# EAGLE design module (EAGLE 9.5.1)

## Sheet 1 of 2: Connector
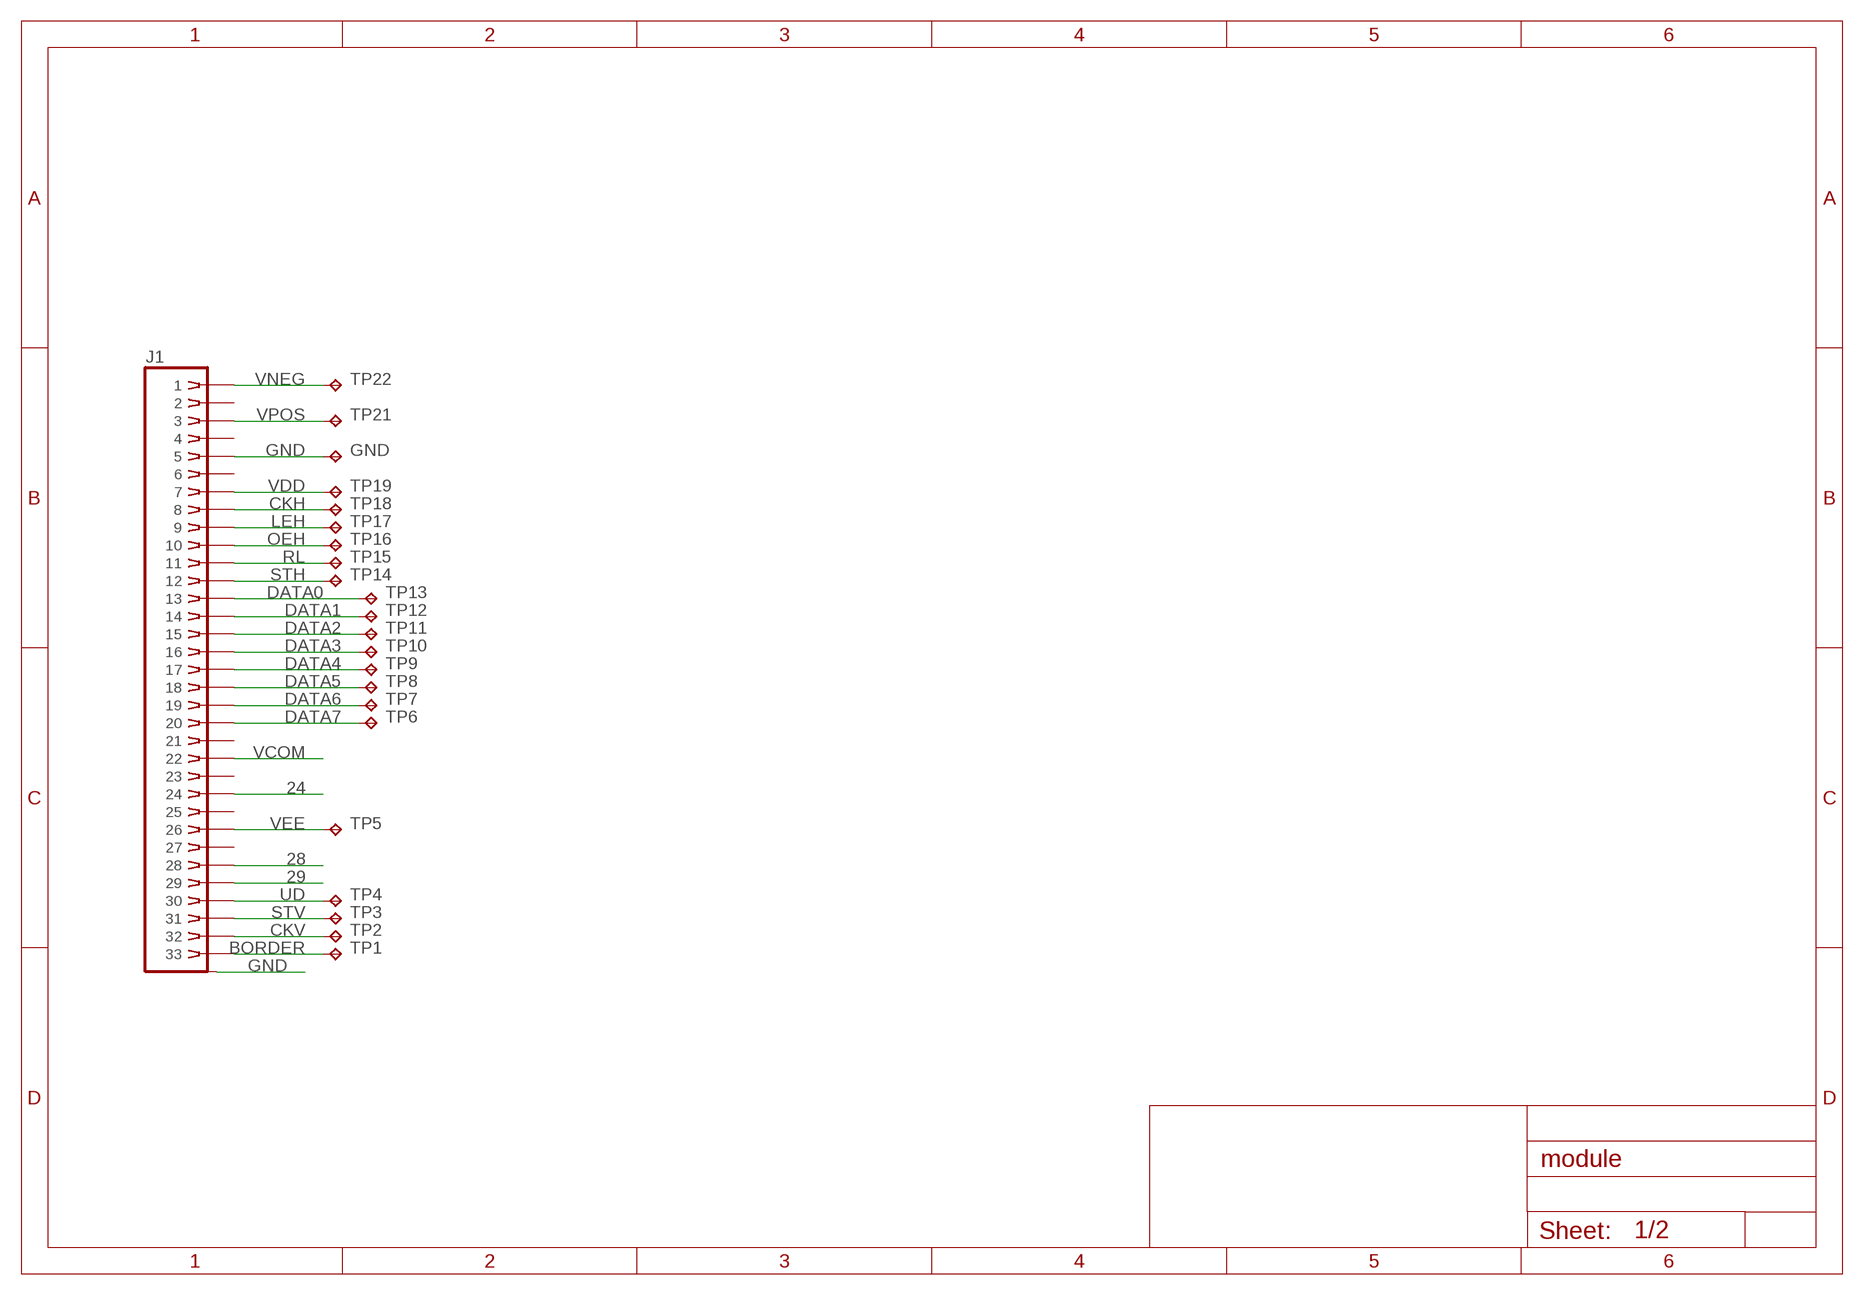
[diagram p0: schematic, sheet 1]

### Parts
GND  TPB1,27  [B1,27]
J1  SFV33R  [SFV33R-1STE1LF]
TP1  TPB1,27  [B1,27]
TP2  TPB1,27  [B1,27]
TP3  TPB1,27  [B1,27]
TP4  TPB1,27  [B1,27]
TP5  TPB1,27  [B1,27]
TP6  TPB1,27  [B1,27]
TP7  TPB1,27  [B1,27]
TP8  TPB1,27  [B1,27]
TP9  TPB1,27  [B1,27]
TP10  TPB1,27  [B1,27]
TP11  TPB1,27  [B1,27]
TP12  TPB1,27  [B1,27]
TP13  TPB1,27  [B1,27]
TP14  TPB1,27  [B1,27]
TP15  TPB1,27  [B1,27]
TP16  TPB1,27  [B1,27]
TP17  TPB1,27  [B1,27]
TP18  TPB1,27  [B1,27]
TP19  TPB1,27  [B1,27]
TP21  TPB1,27  [B1,27]
TP22  TPB1,27  [B1,27]

### Nets
24: J1.24
28: J1.28
29: J1.29
BORDER: J1.33 TP1.TP
CKH: J1.8 TP18.TP
CKV: J1.32 TP2.TP
DATA0: J1.13 TP13.TP
DATA1: J1.14 TP12.TP
DATA2: J1.15 TP11.TP
DATA3: J1.16 TP10.TP
DATA4: J1.17 TP9.TP
DATA5: J1.18 TP8.TP
DATA6: J1.19 TP7.TP
DATA7: J1.20 TP6.TP
GND: GND.TP J1.5 J1.SHLD1(SHLD) J1.SHLD2(SHLD) ; also sheet 2
LEH: J1.9 TP17.TP
OEH: J1.10 TP16.TP
RL: J1.11 TP15.TP
STH: J1.12 TP14.TP
STV: J1.31 TP3.TP
UD: J1.30 TP4.TP
VCOM: J1.22 ; also sheet 2
VDD: J1.7 TP19.TP
VEE: J1.26 TP5.TP ; also sheet 2
VNEG: J1.1 TP22.TP ; also sheet 2
VPOS: J1.3 TP21.TP ; also sheet 2
Unconnected: J1.2 J1.4 J1.6 J1.21 J1.23 J1.25 J1.27

## Sheet 2 of 2: Power
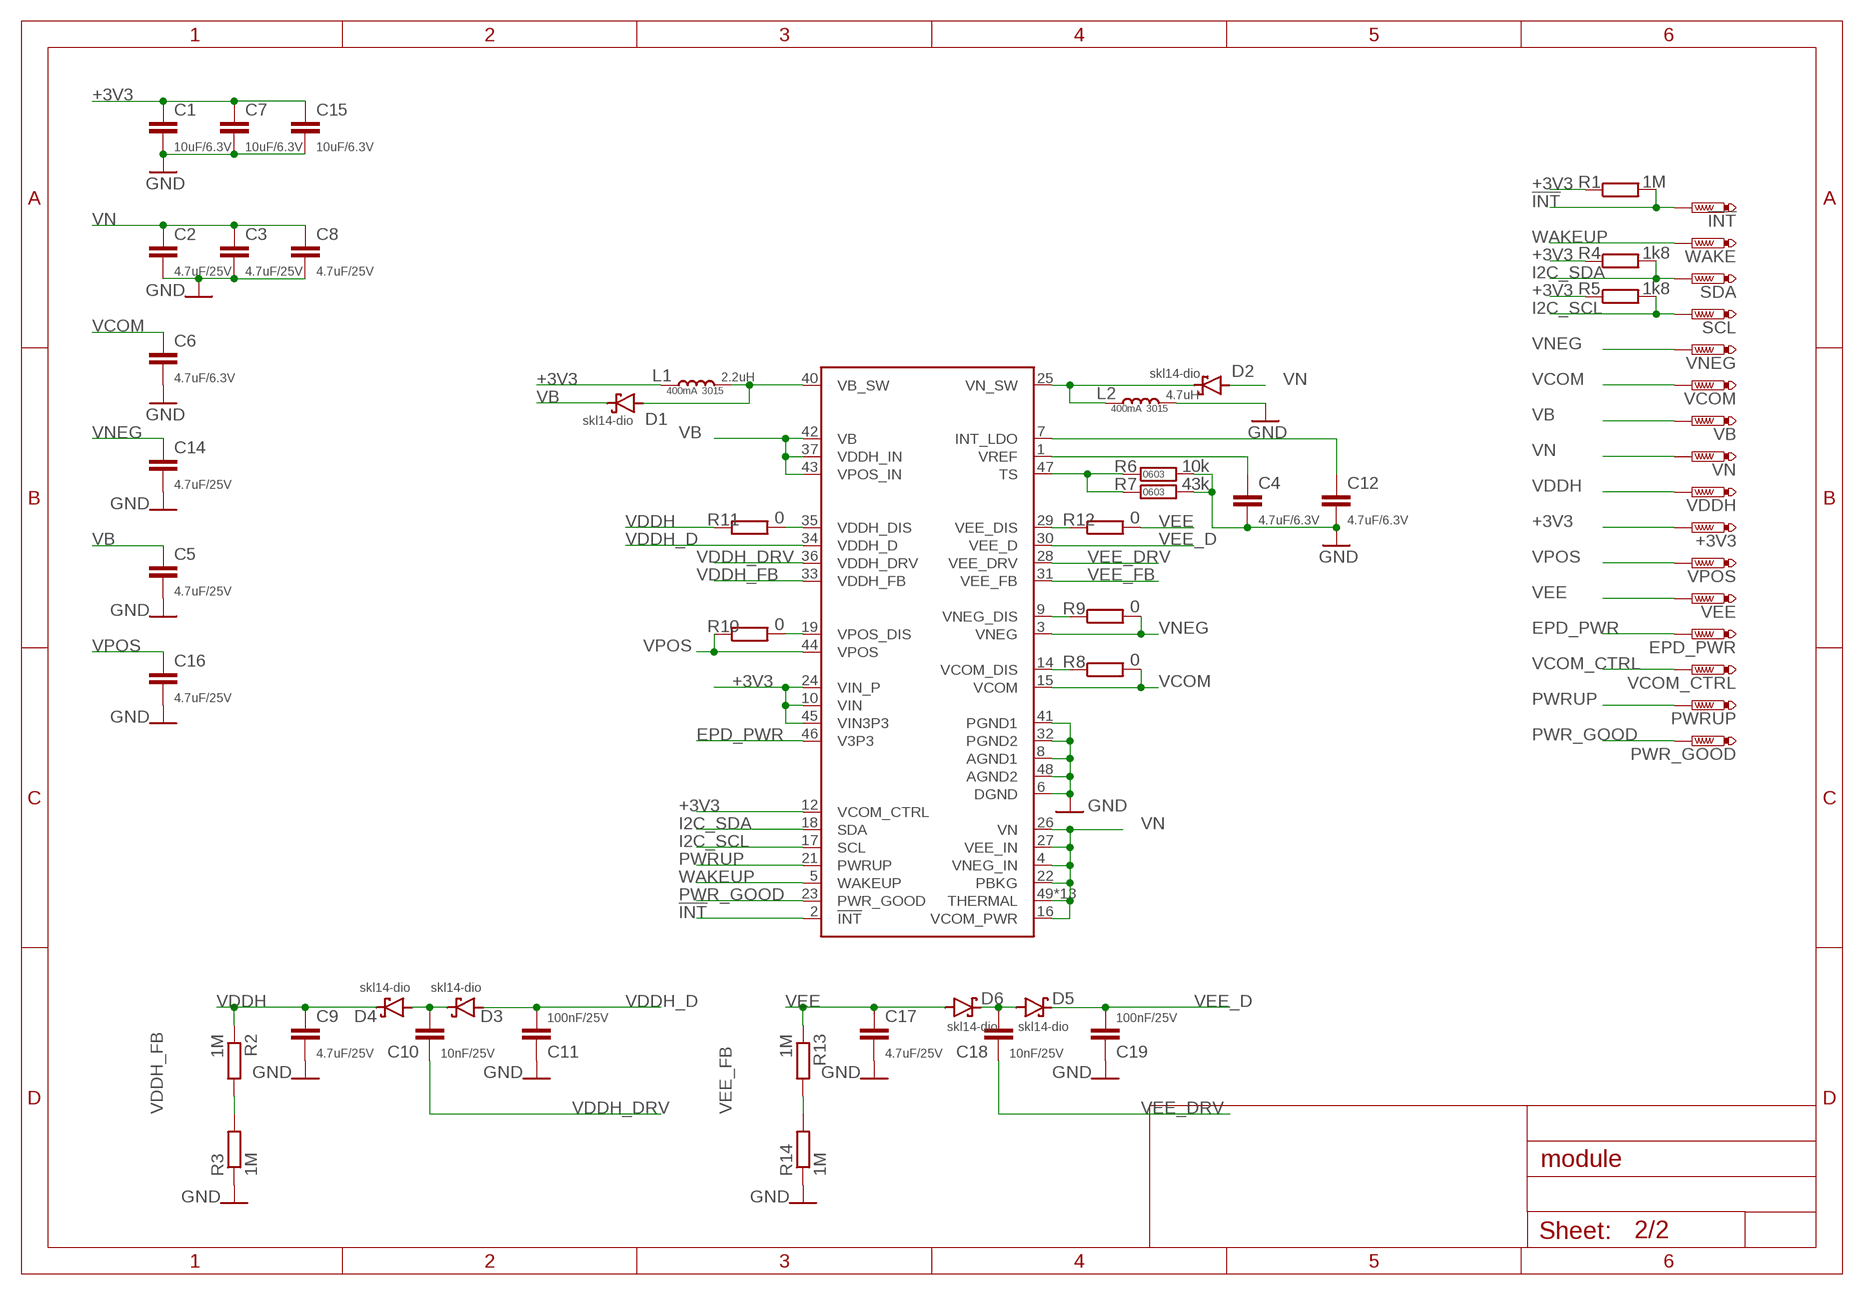
[diagram p1: schematic, sheet 2]

### Parts
!INT  PTR1B1,27  [B1,27]
+3V3  PTR1B1,27  [B1,27]
C1  10uF/6.3V  C-EUC0805  [C0805]
C2  4.7uF/25V  C-EUC0805  [C0805]
C3  4.7uF/25V  C-EUC0805  [C0805]
C4  4.7uF/6.3V  C-EUC0603  [C0603]
C5  4.7uF/25V  C-EUC0805  [C0805]
C6  4.7uF/6.3V  C-EUC0603  [C0603]
C7  10uF/6.3V  C-EUC0805  [C0805]
C8  4.7uF/25V  C-EUC0805  [C0805]
C9  4.7uF/25V  C-EUC0805  [C0805]
C10  10nF/25V  C-EUC0402  [C0402]
C11  100nF/25V  C-EUC0603  [C0603]
C12  4.7uF/6.3V  C-EUC0603  [C0603]
C14  4.7uF/25V  C-EUC0805  [C0805]
C15  10uF/6.3V  C-EUC0805  [C0805]
C16  4.7uF/25V  C-EUC0805  [C0805]
C17  4.7uF/25V  C-EUC0805  [C0805]
C18  10nF/25V  C-EUC0402  [C0402]
C19  100nF/25V  C-EUC0603  [C0603]
D1  skl14-dio  SKL14  [SODFL3718X130]
D2  skl14-dio  SKL14  [SODFL3718X130]
D3  skl14-dio  SKL14  [SODFL3718X130]
D4  skl14-dio  SKL14  [SODFL3718X130]
D5  skl14-dio  SKL14  [SODFL3718X130]
D6  skl14-dio  SKL14  [SODFL3718X130]
EPD_PWR  PTR1B1,27  [B1,27]
L1  2.2uH  DJNR3015  [L3230M]
L2  4.7uH  DJNR3015  [L3230M]
PWR_GOOD  PTR1B1,27  [B1,27]
PWRUP  PTR1B1,27  [B1,27]
R1  1M  R-EU_R0603  [R0603]
R2  1M  R-EU_R0603  [R0603]
R3  1M  R-EU_R0603  [R0603]
R4  1k8  R-EU_R0603  [R0603]
R5  1k8  R-EU_R0603  [R0603]
R6  10k  RES-0603  [R0603]
R7  43k  RES-0603  [R0603]
R8  0  R-EU_R0402  [R0402]
R9  0  R-EU_R0402  [R0402]
R10  0  R-EU_R0402  [R0402]
R11  0  R-EU_R0402  [R0402]
R12  0  R-EU_R0402  [R0402]
R13  1M  R-EU_R0603  [R0603]
R14  1M  R-EU_R0603  [R0603]
SCL  PTR1B1,27  [B1,27]
SDA  PTR1B1,27  [B1,27]
U1  TPS65185  [QFN50P700X700X100-49T410]
VB  PTR1B1,27  [B1,27]
VCOM  PTR1B1,27  [B1,27]
VCOM_CTRL  PTR1B1,27  [B1,27]
VDDH  PTR1B1,27  [B1,27]
VEE  PTR1B1,27  [B1,27]
VN  PTR1B1,27  [B1,27]
VNEG  PTR1B1,27  [B1,27]
VPOS  PTR1B1,27  [B1,27]
WAKE  PTR1B1,27  [B1,27]

### Nets
!INT: !INT.TP R1.2 U1.2(!INT)
+3V3: +3V3.TP C1.1 C7.1 C15.1 L1.1 R1.1 R4.1 R5.1 U1.10(VIN) U1.12(VCOM_CTRL) U1.24(VIN_P) U1.45(VIN3P3)
EPD_PWR: EPD_PWR.TP U1.46(V3P3)
GND: C1.2 C2.2 C3.2 C4.2 C5.2 C6.2 C7.2 C8.2 C9.2 C11.2 C12.2 C14.2 C15.2 C16.2 C17.2 C19.2 L2.2 R3.1 R6.2 R7.2 R14.1 U1.6(DGND) U1.8(AGND1) U1.32(PGND2) U1.41(PGND1) U1.48(AGND2) ; also sheet 1
I2C_SCL: R5.2 SCL.TP U1.17(SCL)
I2C_SDA: R4.2 SDA.TP U1.18(SDA)
N$1: C12.1 U1.7(INT_LDO)
N$2: D1.A L1.2 U1.40(VB_SW)
N$3: D2.C L2.1 U1.25(VN_SW)
N$4: C4.1 U1.1(VREF)
N$6: C10.1 D3.C D4.A
N$7: R8.1 U1.14(VCOM_DIS)
N$8: C18.1 D5.A D6.C
N$9: R9.1 U1.9(VNEG_DIS)
N$11: R10.2 U1.19(VPOS_DIS)
N$14: R12.1 U1.29(VEE_DIS)
N$15: R11.2 U1.35(VDDH_DIS)
NTC_SENSE: R6.1 R7.1 U1.47(TS)
PWR_GOOD: PWR_GOOD.TP U1.23(PWR_GOOD)
PWRUP: PWRUP.TP U1.21(PWRUP)
VB: C5.1 D1.C U1.37(VDDH_IN) U1.42(VB) U1.43(VPOS_IN) VB.TP
VCOM: C6.1 R8.2 U1.15(VCOM) VCOM.TP ; also sheet 1
VCOM_CTRL: VCOM_CTRL.TP
VDDH: C9.1 D4.C R2.1 R11.1 VDDH.TP
VDDH_D: C11.1 D3.A U1.34(VDDH_D)
VDDH_DRV: C10.2 U1.36(VDDH_DRV)
VDDH_FB: R2.2 R3.2 U1.33(VDDH_FB)
VEE: C17.1 D6.A R12.2 R13.1 VEE.TP ; also sheet 1
VEE_D: C19.1 D5.C U1.30(VEE_D)
VEE_DRV: C18.2 U1.28(VEE_DRV)
VEE_FB: R13.2 R14.2 U1.31(VEE_FB)
VN: C2.1 C3.1 C8.1 D2.A U1.4(VNEG_IN) U1.16(VCOM_PWR) U1.22(PBKG) U1.26(VN) U1.27(VEE_IN) U1.49(THERMAL) U1.P$1(THERMAL) U1.P$2(THERMAL) U1.P$3(THERMAL) U1.P$4(THERMAL) U1.P$5(THERMAL) U1.P$6(THERMAL) U1.P$7(THERMAL) U1.P$8(THERMAL) U1.P$9(THERMAL) U1.P$10(THERMAL) U1.P$11(THERMAL) U1.P$12(THERMAL) VN.TP
VNEG: C14.1 R9.2 U1.3(VNEG) VNEG.TP ; also sheet 1
VPOS: C16.1 R10.1 U1.44(VPOS) VPOS.TP ; also sheet 1
WAKEUP: U1.5(WAKEUP) WAKE.TP

## Library data of the parts
!INT +3V3 EPD_PWR PWR_GOOD PWRUP SCL SDA VB VCOM VCOM_CTRL VDDH VEE VN VNEG VPOS WAKE = testpad:PTR1: TEST PIN
C1-C12 C14-C19 = rcl:C-EU: CAPACITOR, European symbol; SPICEPREFIX: C
D1-D6 = parts-diotec:SKL
GND TP1-TP19 TP21 TP22 = testpad:TP: Test pad
J1 = parts-amphenol:SFV33R
L1 L2 = parts-ferrocore:DJNR3015; CURRENT: 400mA; PACKAGE: 3015
R1-R5 R8-R14 = rcl:R-EU_: RESISTOR, European symbol; SPICEPREFIX: R
R6 R7 = parts-passives:RES-; PACKAGE: 0603
U1 = parts-ti:TPS65185

## Board
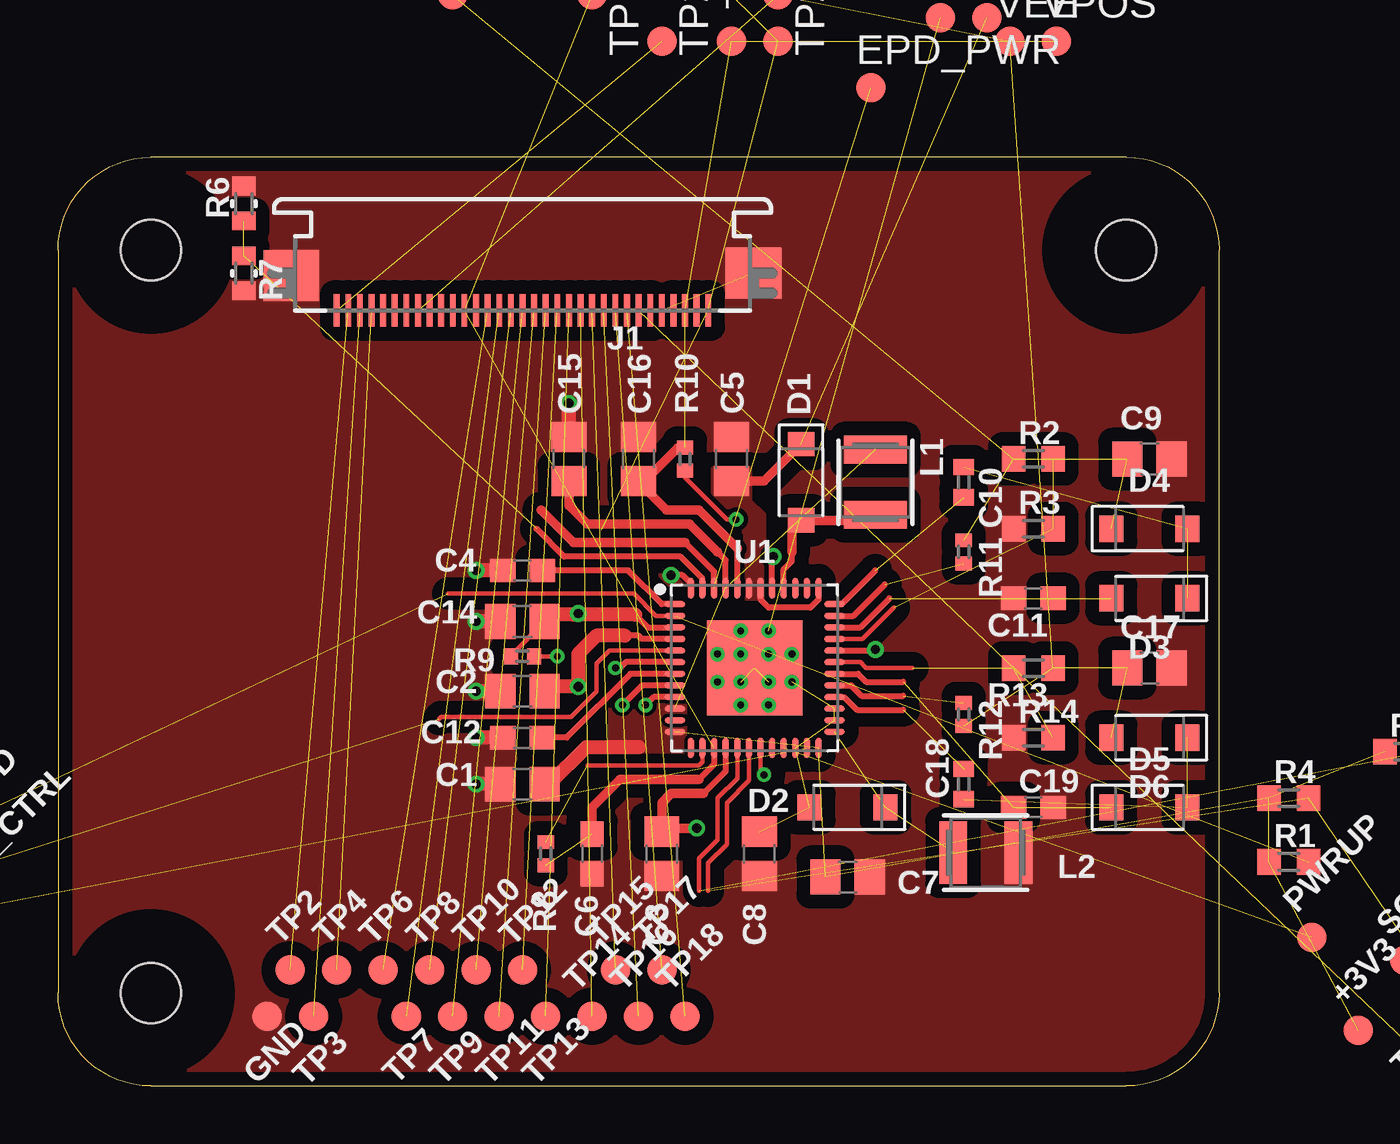
[diagram p2: board, top side]
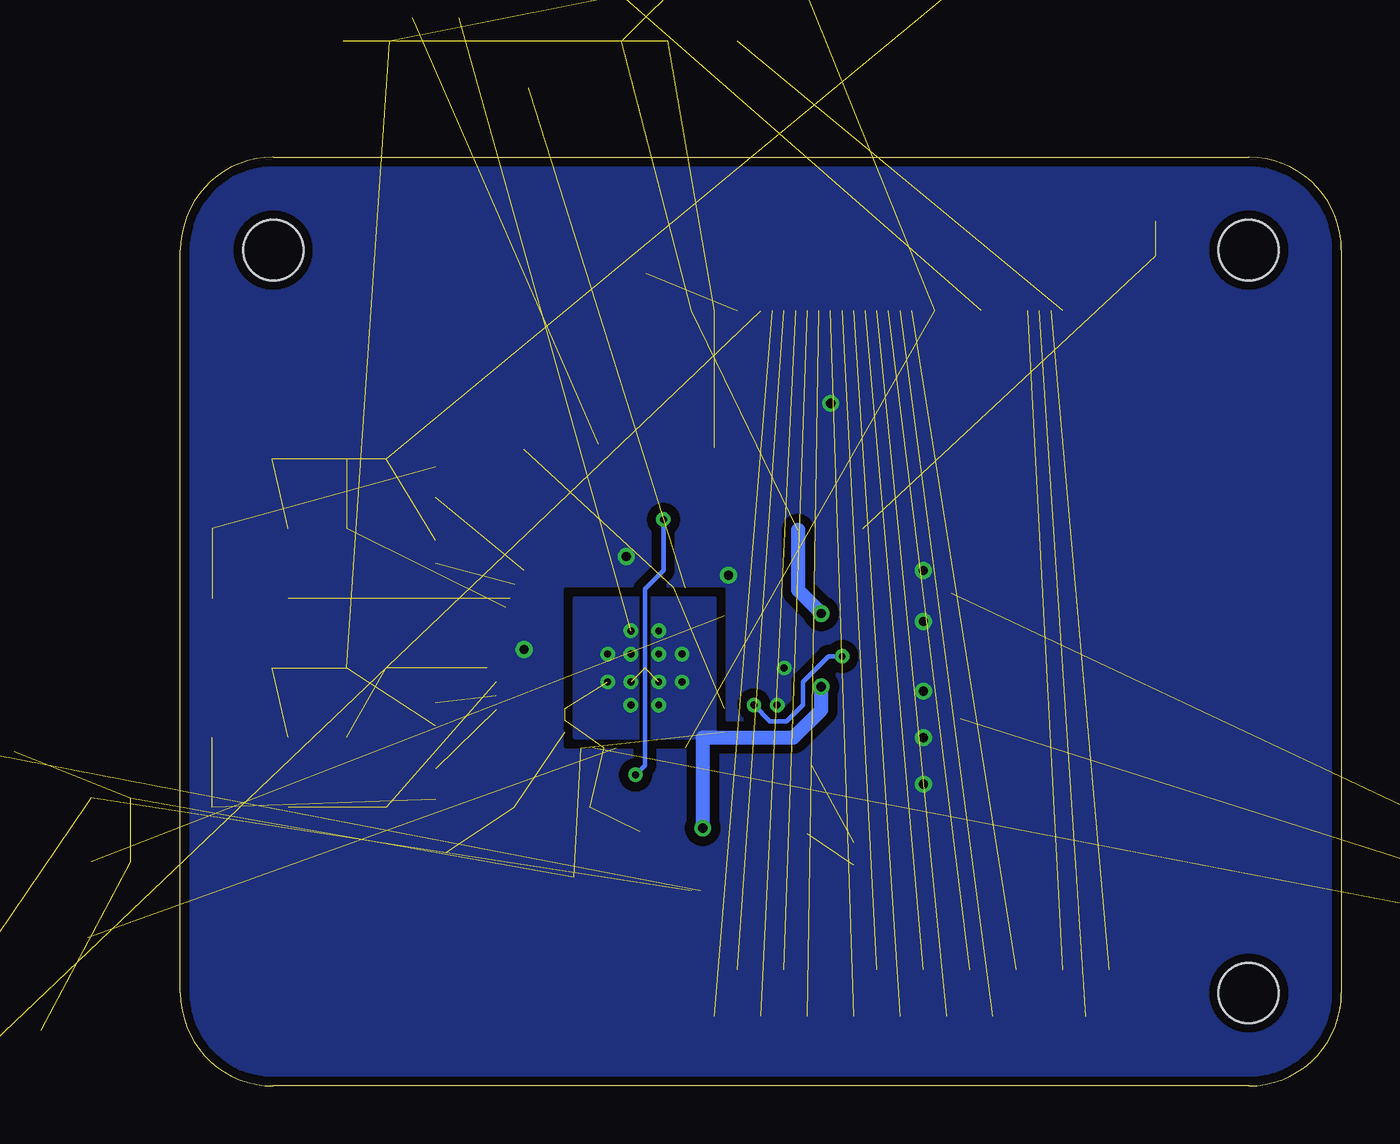
[diagram p3: board, bottom side, seen from below]

Size 50 x 40 mm. Coordinates in mm from the lower left corner, seen from the top.
Outline: 4,0 46,0 arc90 50,4 50,36 arc90 46,40 4,40 arc90 0,36 0,4 arc90 4,0
Copper layers (1*16): Top 0.035mm / dielectric 0.97mm / Bottom 0.035mm
Design rules "default *": minimum track width 0.154mm, minimum drill 0.3mm, track to track 6mil, track to pad 6mil, pad to pad 6mil, via to via 6mil, smd to smd 6mil, copper to edge 0.4mm, drill to drill 6mil, minimum pad ring 0.16mm, minimum via ring 0.16mm, stop-mask expansion 4mil, vias tented up to drill 0mil, thermal gap 10mil
Holes 2.6 mm at 4,36 4,4 46,36
tRestrict: area 1,33 to 7,39; area 1,1 to 7,7; area 43,33 to 49,39

### Footprints (pad centres in the part's own frame; a part is rotated, then mirrored left to right if it is on the bottom)
B1,27 = smd 1.27 x 1.27: TP 0,0
C0805 = smd 1.3 x 1.5: 1 -0.95,0; 2 0.95,0
C0603 = smd 1.1 x 1: 1 -0.85,0; 2 0.85,0
C0402 = smd 0.7 x 0.9: 1 -0.65,0; 2 0.65,0
SODFL3718X130 = smd 1.036 x 1.129: A 1.639,0; C -1.639,0
SFV33R-1STE1LF = smd 0.25 x 1.4: 1 -8,0.6; 2 -7.5,0.6; 3 -7,0.6; 4 -6.5,0.6; 5 -6,0.6; 6 -5.5,0.6; 7 -5,0.6; 8 -4.5,0.6; 9 -4,0.6; 10 -3.5,0.6; 11 -3,0.6; 12 -2.5,0.6; 13 -2,0.6; 14 -1.5,0.6; 15 -1,0.6; 16 -0.5,0.6; 17 0,0.6; 18 0.5,0.6; 19 1,0.6; 20 1.5,0.6; 21 2,0.6; 22 2.5,0.6; 23 3,0.6; 24 3.5,0.6; 25 4,0.6; 26 4.5,0.6; 27 5,0.6; 28 5.5,0.6; 29 6,0.6; 30 6.5,0.6; 31 7,0.6; 32 7.5,0.6; 33 8,0.6 | smd 2.4 x 2.2: SHLD1 -9.95,-1; SHLD2 9.95,-0.9
L3230M = smd 1.2 x 2.7: 1 -1.4,0; 2 1.4,0
R0603 = smd 1 x 1.1: 1 -0.85,0; 2 0.85,0
R0603' = smd 0.8 x 1: 1 -0.75,0; 2 0.75,0
R0402 = smd 0.6 x 0.7: 1 -0.5,0; 2 0.5,0
QFN50P700X700X100-49T410 = smd 0.896 x 0.264: 1 -3.437,2.75; 2 -3.437,2.25; 3 -3.437,1.75; 4 -3.437,1.25; 5 -3.437,0.75; 6 -3.437,0.25; 7 -3.437,-0.25; 8 -3.437,-0.75; 9 -3.437,-1.25; 10 -3.437,-1.75; 11 -3.437,-2.25; 12 -3.437,-2.75; 25 3.437,-2.75; 26 3.437,-2.25; 27 3.437,-1.75; 28 3.437,-1.25; 29 3.437,-0.75; 30 3.437,-0.25; 31 3.437,0.25; 32 3.437,0.75; 33 3.437,1.25; 34 3.437,1.75; 35 3.437,2.25; 36 3.437,2.75 | smd 0.264 x 0.896: 13 -2.75,-3.437; 14 -2.25,-3.437; 15 -1.75,-3.437; 16 -1.25,-3.437; 17 -0.75,-3.437; 18 -0.25,-3.437; 19 0.25,-3.437; 20 0.75,-3.437; 21 1.25,-3.437; 22 1.75,-3.437; 23 2.25,-3.437; 24 2.75,-3.437; 37 2.75,3.437; 38 2.25,3.437; 39 1.75,3.437; 40 1.25,3.437; 41 0.75,3.437; 42 0.25,3.437; 43 -0.25,3.437; 44 -0.75,3.437; 45 -1.25,3.437; 46 -1.75,3.437; 47 -2.25,3.437; 48 -2.75,3.437 | smd 4.1 x 4.1: 49 0,0 | drill 0.3 pad 0.4: P$1 0.6,0.6; P$2 0.6,-0.6; P$3 -0.6,-0.6; P$4 -0.6,0.6; P$5 0.6,1.6; P$6 -0.6,1.6; P$7 1.6,0.6; P$8 1.6,-0.6; P$9 0.6,-1.6; P$10 -0.6,-1.6; P$11 -1.6,-0.6; P$12 -1.6,0.6

### Placement (x,y rotation side)
!INT  -7,10 0 top  (outside the outline)
+3V3  56,2.4 0 top  (outside the outline)
C1  20,13 180 top
C2  20,17 180 top
C3  26,10 270 top
C4  20,22.2 180 top
C5  29,27 90 top
C6  23,10 270 top
C7  34,9 0 top
C8  30.2,10 270 top
C9  47,27 0 top
C10  39,26 270 top
C11  42,21 180 top
C12  20,15 180 top
C14  20,20 180 top
C15  22,27 90 top
C16  25,27 90 top
C17  47,18 0 top
C18  39,13 90 top
C19  42,12 0 top
D1  32,26 270 top
D2  34,12 180 top
D3  47,21 180 top
D4  47,24 0 top
D5  47,12 0 top
D6  47,15 180 top
EPD_PWR  35,43 0 top
GND  9,3 90 top
J1  20,34 180 top
L1  35.2,26 270 top
L2  39.95,10.05 0 top
PWR_GOOD  -7,7 0 top  (outside the outline)
PWRUP  54,6.4 0 top  (outside the outline)
R1  53,9.65 0 top
R2  42,27 0 top
R3  42,24 0 top
R4  53,12.4 0 top
R5  58,14.4 0 top  (outside the outline)
R6  10k  [R0603']  8,38 90 top
R7  43k  [R0603']  8,35 270 top
R8  21,10 270 top
R9  20,18.5 180 top
R10  27,27 270 top
R11  39,23 270 top
R12  39,16 270 top
R13  42,18 180 top
R14  42,15 0 top
SCL  58,5.4 0 top  (outside the outline)
SDA  60,3.4 0 top  (outside the outline)
TP1  26,45 90 top  (outside the outline)
TP2  10,5 0 top
TP3  11,3 0 top
TP4  12,5 0 top
TP5  31,47 90 top  (outside the outline)
TP6  14,5 0 top
TP7  15,3 0 top
TP8  16,5 90 top
TP9  17,3 90 top
TP10  18,5 90 top
TP11  19,3 90 top
TP12  20,5 90 top
TP13  21,3 90 top
TP14  23,3 0 top
TP15  24,5 0 top
TP16  25,3 0 top
TP17  26,5 0 top
TP18  27,3 0 top
TP19  59,1 90 top  (outside the outline)
TP21  29,45 90 top  (outside the outline)
TP22  31,45 90 top  (outside the outline)
U1  30,18 0 top
VB  40,46 0 top  (outside the outline)
VCOM  23,47 0 top  (outside the outline)
VCOM_CTRL  -5,6 0 top  (outside the outline)
VDDH  17,47 0 top  (outside the outline)
VEE  41,45 0 top  (outside the outline)
VN  38,46 0 top  (outside the outline)
VNEG  28,48 0 top  (outside the outline)
VPOS  43,45 0 top  (outside the outline)
WAKE  -5,9 0 top  (outside the outline)

### Tracks (layer width: path | path; a pad name or v marks a point on that pad's centre or on a via)
!INT  (2 unrouted)
  Top 0.2: U1.2 25.75,20.25 24.8,21.2 16.8,21.2
+3V3  (8 unrouted)
  Top 0.25: U1.45 28.75,22.65 28.4,23
  Top 0.4: 28.4,23 27.2,24.2 22.8,24.2 22,25 C15.1
  Top 0.6: C1.1 21.15,13 22.75,14.6 25,14.6
  pour Top (isolate 0.15, no thermals): 27,16.4 27,14.4 23.8,14.4 23.8,16.4
BORDER  (1 unrouted)
CKH  (1 unrouted)
CKV  (1 unrouted)
DATA0  (1 unrouted)
DATA1  (1 unrouted)
DATA2  (1 unrouted)
DATA3  (1 unrouted)
DATA4  (1 unrouted)
DATA5  (1 unrouted)
DATA6  (1 unrouted)
DATA7  (1 unrouted)
EPD_PWR  (1 unrouted)
  Top 0.25: U1.46 28.25,22.15 27,23.4
  Top 0.4: 20.8,24.8 22.2,23.4 27,23.4
GND  (via drill 0.3, 0.4)  (1 unrouted)
  Top 0.25: 33.85,18.75 U1.32 35.15,18.75 v35.2,18.8 | U1.6 24.45,18.25 24.2,18 v24,18 | U1.8 25.15,17.25 v24.3,16.4 | U1.48 27.25,21.64 26.89,22 v26.4,22 | U1.41 30.75,22.75 v30.8,22.8
  Top 0.6: C4.2 v18,22.2 | C14.2 v18,20 | C2.2 v18,17 | C12.2 v18,15 | C1.2 v18,13 | C15.2 v22,29.4
  pour Bottom (isolate 0.4, rank 6): -1,-1 -1,42 51,42 51,-1
  pour Top (isolate 0.6, rank 6, no thermals): -2,43 -2,-2 52,-2 52,43
I2C_SCL  (2 unrouted)
  Top 0.2: U1.17 29.25,13.25 28.4,12.4 28.4,10.6 27.6,9.8 27.6,8.4
I2C_SDA  (2 unrouted)
  Top 0.2: U1.18 29.75,13.15 28.8,12.2 28.8,10.4 28,9.6 28,8.4
LEH  (1 unrouted)
N$1
  Top 0.25: U1.7 24.65,17.75 21.9,15 C12.1
N$2
  Top 0.25: U1.40 31.25,22.25 31.6,22.6 31.6,23
  Top 0.4: 31.6,23 31.6,23.96 D1.A 34.96,24.36 L1.2
N$3  (2 unrouted)
N$4
  Top 0.25: U1.1 26,20.75 24.55,22.2 C4.1
N$6  (2 unrouted)
N$7  (1 unrouted)
  Top 0.2: U1.14 27.75,13.95 27.6,13.8 22.8,13.8
N$8  (2 unrouted)
N$9  (via drill 0.3)
  Top 0.2: v21.5,18.5 R9.1
  Top 0.25: U1.9 25.65,16.75 v25.3,16.4
  Bottom 0.2: v25.3,16.4 24.6,15.7 23.9,15.7 23.2,16.4 23.2,17.4 22.1,18.5 v21.5,18.5
N$11  (via drill 0.3)
  Top 0.2: U1.19 30.25,13.55 v30.4,13.4 | v29.2,24.4 28.8,24.4 27,26.2 R10.2
  Bottom 0.2: v30.4,13.4 30,13.8 30,21.4 29.2,22.2 v29.2,24.4
N$14  (1 unrouted)
  Top 0.25: U1.29 34.15,17.25 34.6,16.8 36.4,16.8
N$15  (1 unrouted)
  Top 0.25: U1.35 34.25,20.25 35.6,21.6
NTC_SENSE  (2 unrouted)
  Top 0.25: U1.47 27.75,21.85 26.8,22.8 21.8,22.8 20.6,24
OEH  (1 unrouted)
PWR_GOOD  (1 unrouted)
PWRUP  (1 unrouted)
RL  (1 unrouted)
STH  (1 unrouted)
STV  (1 unrouted)
UD  (1 unrouted)
VB  (1 unrouted)
  Top 0.25: U1.37 32.75,20.96 32.71,20.92 32.71,20.91 32.4,20.6 30.6,20.6 30.25,20.95 U1.42
  Top 0.4: C5.1 30.41,26.05 D1.C
  pour Top (isolate 0.2, no thermals): 29.6,21 30.4,21 30.4,24.6 29.8,25.2 29.8,26.6 28.2,26.6 28.2,25.2 29.6,23.8
VCOM  (3 unrouted)
  Top 0.25: U1.15 28.25,13.85 27.6,13.2
  Top 0.4: C6.1 23,12 24.2,13.2 27.6,13.2
VDD  (1 unrouted)
VDDH  (4 unrouted)
VDDH_D  (2 unrouted)
  Top 0.25: U1.34 34.55,19.75 35.8,21
VDDH_DRV  (1 unrouted)
  Top 0.25: U1.36 33.75,20.75 35.2,22.2
VDDH_FB  (2 unrouted)
  Top 0.2: U1.33 34.65,19.25 36,20.6
VEE  (6 unrouted)
VEE_D  (2 unrouted)
  Top 0.25: U1.30 34.45,17.75 34.8,17.4 36.4,17.4
VEE_DRV  (1 unrouted)
  Top 0.25: U1.28 33.85,16.75 34.4,16.2 36.4,16.2
VEE_FB  (2 unrouted)
  Top 0.2: U1.31 34.55,18.25 34.8,18 36.8,18
VN  (via drill 0.4)  (8 unrouted)
  Top 0.25: U1.4 25.15,19.25 25,19.4 24.4,19.4 | U1.16 28.75,13.55 27.8,12.6
  Top 0.4: 27.8,12.6 26.4,12.6 26,12.2 C3.1 26.15,11.1 v27.5,11.1
  Top 0.6: C2.1 21.15,17.2 v22.4,17.2 22.4,18.6 23.2,19.4 24.4,19.4
  Bottom 0.6: v22.4,17.2 22.4,16.2 23.6,15 27.5,15 v27.5,11.1
  pour Bottom (rank 2, no thermals): 27,21 27,15 33,15 33,21
VNEG  (via drill 0.4)  (3 unrouted)
  Top 0.2: C14.1 19.5,18.55 R9.2
  Top 0.25: 24.85,20.3 25.4,19.75 U1.3
  Top 0.4: v22.4,20.35 22.35,20.3 22.2,20.3
  Top 0.6: 24.85,20.3 22.2,20.3 21.25,20.3 C14.1
  Bottom 0.6: 23.4,23.95 23.4,21.35 v22.4,20.35
VPOS  (3 unrouted)
  Top 0.25: U1.44 29.25,23.15 29.2,23.2
  Top 0.4: 29.25,23.15 27.6,24.8 26.2,24.8 25,26 C16.1 25.25,26.05 26.7,27.5 R10.1
WAKEUP  (1 unrouted)
  Top 0.2: U1.5 23.75,18.75 23.2,18.2 23.2,17 22.1,15.9 16.5,15.9 16.4,15.8